# Altium schematic sheet FPGA_PSIO.SchDoc
size A3; SheetNumber: 3; SheetTotal: 5
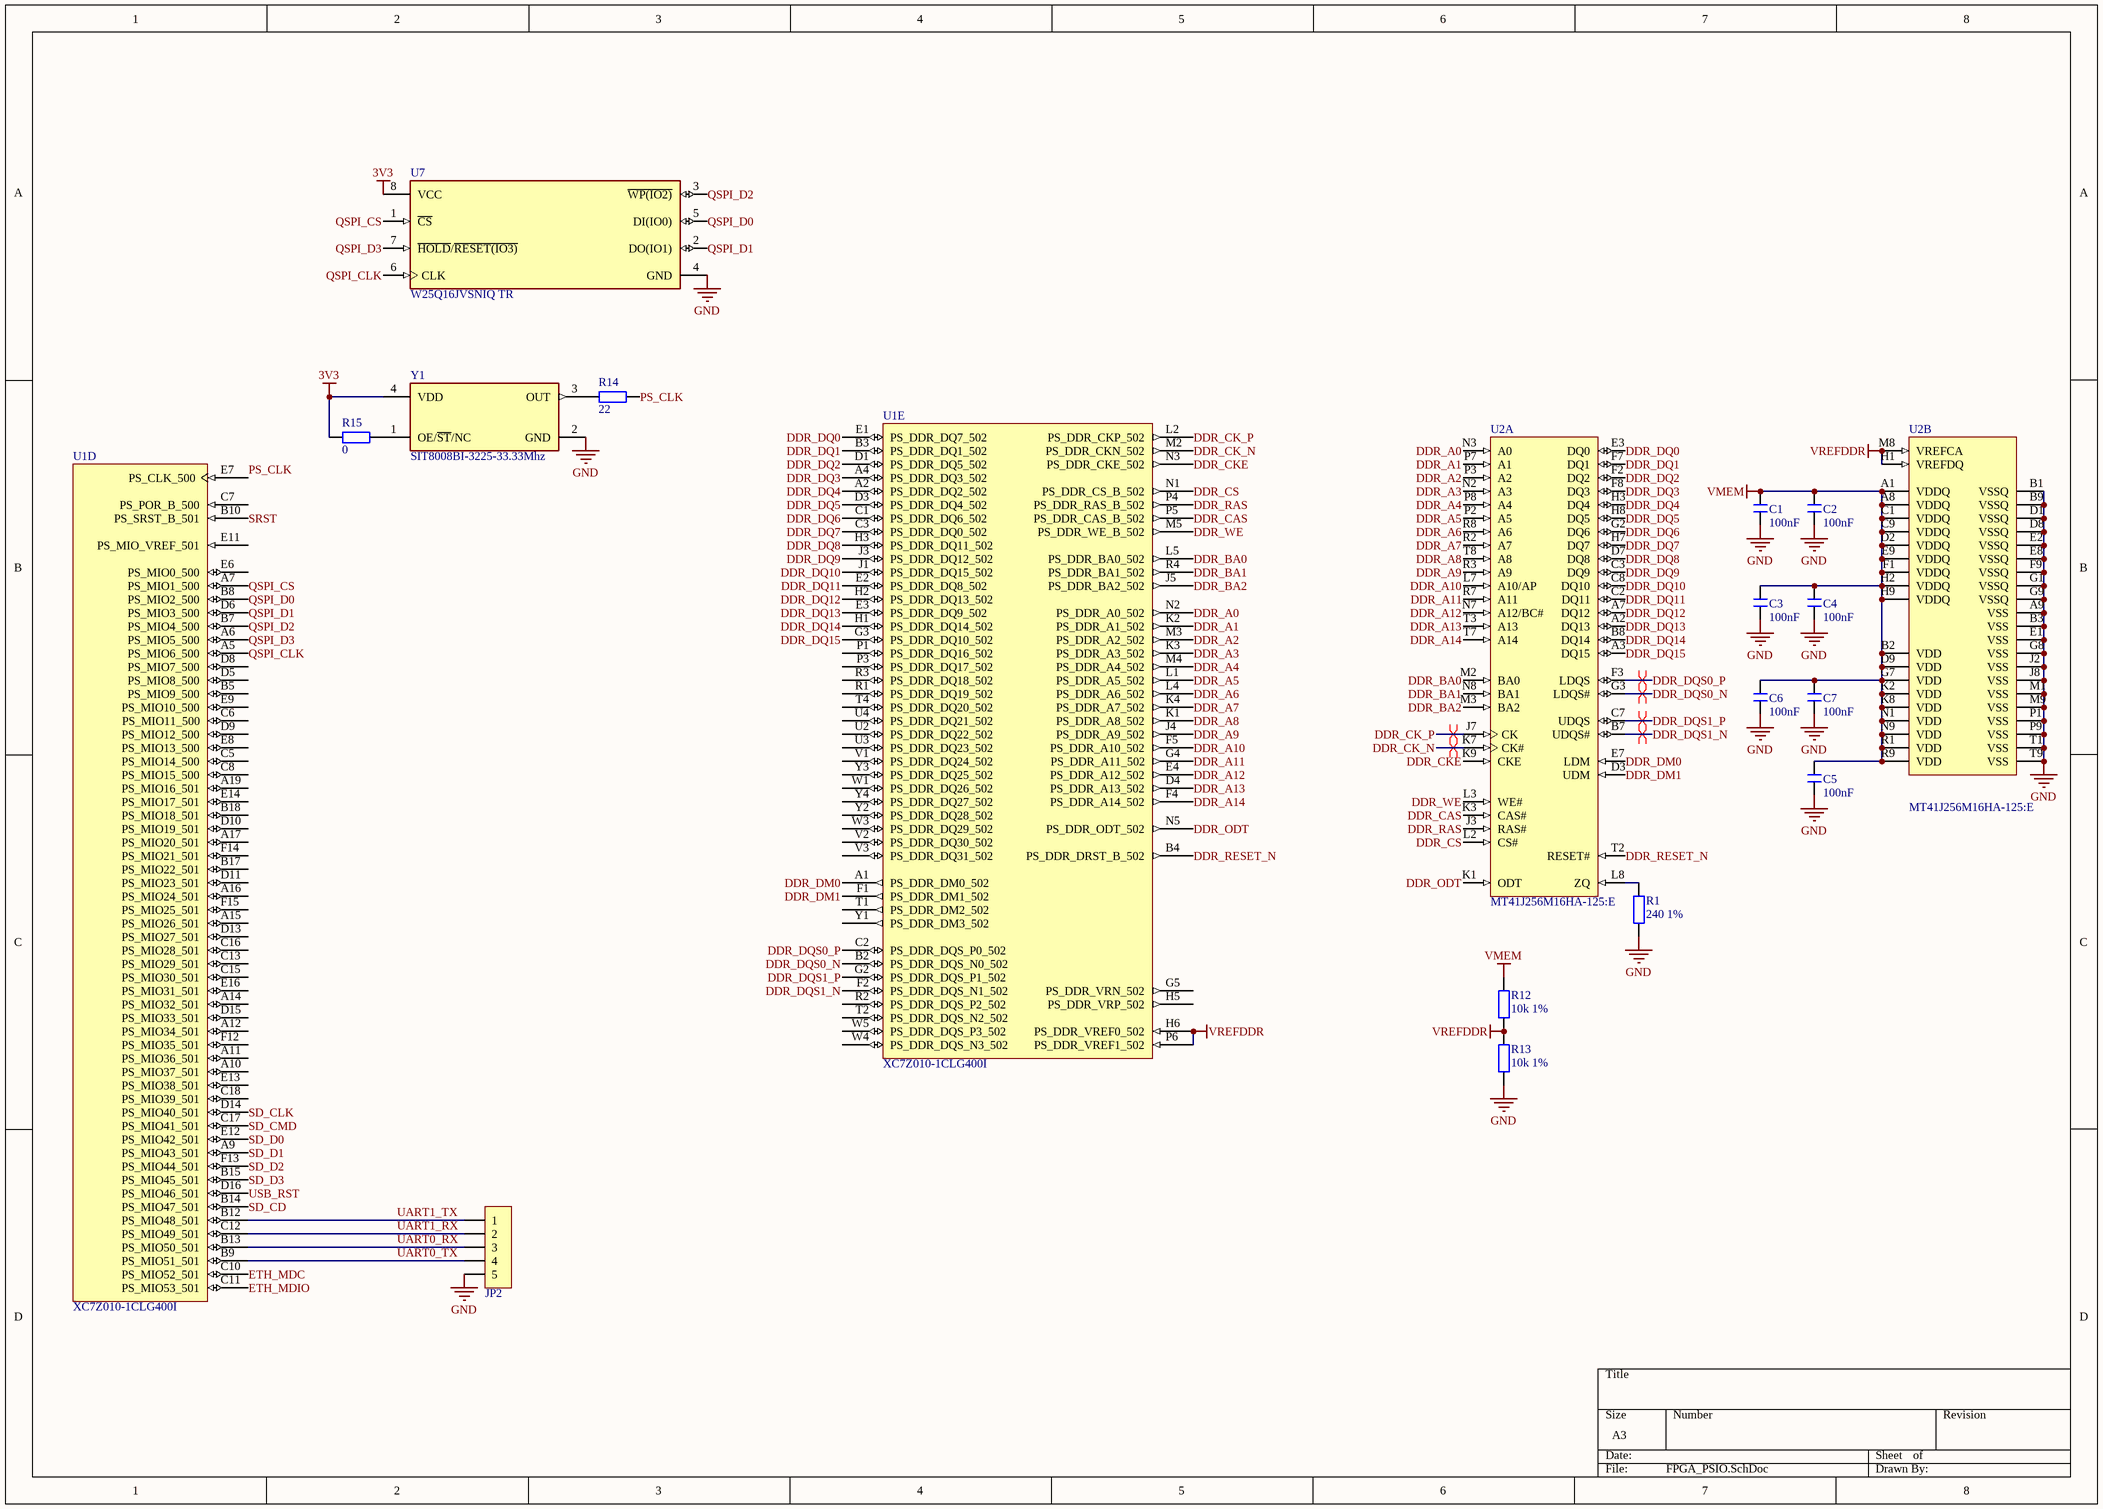
[diagram p0: FPGA_PSIO.SchDoc]

## Parts
C1  100nF  [C0402]
C2  100nF  [C0402]
C3  100nF  [C0402]
C4  100nF  [C0402]
C5  100nF  [C0402]
C6  100nF  [C0402]
C7  100nF  [C0402]
JP2  HDR-1X5  [HDR2.54-LI-5P]  (value not drawn)
R1  240 1%  [R0603]
R12  10k 1%  [R0402]
R13  10k 1%  [R0402]
R14  22  [R0402]
R15  0  [R0402]
U1  XC7Z010-1CLG400I  [CLG400]  (parts D,E of 9)
U2  MT41J256M16HA-125:E  [MICT-HA-96]  (parts A,B of 3)
U7  W25Q16JVSNIQ TR  [FP-SN-MFG]
Y1  SIT8008BI-3225-33.33Mhz  [FP-SiT8008-2-MFG]

## Nets
3V3: R15.1 U7.8(VCC) Y1.4(VDD)
GND: C1.2 C2.2 C3.2 C4.2 C5.2 C6.2 C7.2 JP2.5 R1.1 R13.1 U2.A9(VSS) U2.B1(VSSQ) U2.B3(VSS) U2.B9(VSSQ) U2.D1(VSSQ) U2.D8(VSSQ) U2.E1(VSS) U2.E2(VSSQ) U2.E8(VSSQ) U2.F9(VSSQ) U2.G1(VSSQ) U2.G8(VSS) U2.G9(VSSQ) U2.J2(VSS) U2.J8(VSS) U2.M1(VSS) U2.M9(VSS) U2.P1(VSS) U2.P9(VSS) U2.T1(VSS) U2.T9(VSS) U7.4(GND) Y1.2(GND)
VMEM: C1.1 C2.1 C3.1 C4.1 C5.1 C6.1 C7.1 R12.2 U2.A1(VDDQ) U2.A8(VDDQ) U2.B2(VDD) U2.C1(VDDQ) U2.C9(VDDQ) U2.D2(VDDQ) U2.D9(VDD) U2.E9(VDDQ) U2.F1(VDDQ) U2.G7(VDD) U2.H2(VDDQ) U2.H9(VDDQ) U2.K2(VDD) U2.K8(VDD) U2.N1(VDD) U2.N9(VDD) U2.R1(VDD) U2.R9(VDD)
VREFDDR: R12.1 R13.2 U1.H6(PS_DDR_VREF0_502) U1.P6(PS_DDR_VREF1_502) U2.H1(VREFDQ) U2.M8(VREFCA)
DDR_A0: U1.N2(PS_DDR_A0_502) U2.N3(A0)
DDR_A1: U1.K2(PS_DDR_A1_502) U2.P7(A1)
DDR_A2: U1.M3(PS_DDR_A2_502) U2.P3(A2)
DDR_A3: U1.K3(PS_DDR_A3_502) U2.N2(A3)
DDR_A4: U1.M4(PS_DDR_A4_502) U2.P8(A4)
DDR_A5: U1.L1(PS_DDR_A5_502) U2.P2(A5)
DDR_A6: U1.L4(PS_DDR_A6_502) U2.R8(A6)
DDR_A7: U1.K4(PS_DDR_A7_502) U2.R2(A7)
DDR_A8: U1.K1(PS_DDR_A8_502) U2.T8(A8)
DDR_A9: U1.J4(PS_DDR_A9_502) U2.R3(A9)
DDR_A10: U1.F5(PS_DDR_A10_502) U2.L7(A10/AP)
DDR_A11: U1.G4(PS_DDR_A11_502) U2.R7(A11)
DDR_A12: U1.E4(PS_DDR_A12_502) U2.N7(A12/BC#)
DDR_A13: U1.D4(PS_DDR_A13_502) U2.T3(A13)
DDR_A14: U1.F4(PS_DDR_A14_502) U2.T7(A14)
DDR_BA0: U1.L5(PS_DDR_BA0_502) U2.M2(BA0)
DDR_BA1: U1.R4(PS_DDR_BA1_502) U2.N8(BA1)
DDR_BA2: U1.J5(PS_DDR_BA2_502) U2.M3(BA2)
DDR_CAS: U1.P5(PS_DDR_CAS_B_502) U2.K3(CAS#)
DDR_CK_N: U1.M2(PS_DDR_CKN_502) U2.K7(CK#)
DDR_CK_P: U1.L2(PS_DDR_CKP_502) U2.J7(CK)
DDR_CKE: U1.N3(PS_DDR_CKE_502) U2.K9(CKE)
DDR_CS: U1.N1(PS_DDR_CS_B_502) U2.L2(CS#)
DDR_DM0: U1.A1(PS_DDR_DM0_502) U2.E7(LDM)
DDR_DM1: U1.F1(PS_DDR_DM1_502) U2.D3(UDM)
DDR_DQ0: U1.E1(PS_DDR_DQ7_502) U2.E3(DQ0)
DDR_DQ1: U1.B3(PS_DDR_DQ1_502) U2.F7(DQ1)
DDR_DQ2: U1.D1(PS_DDR_DQ5_502) U2.F2(DQ2)
DDR_DQ3: U1.A4(PS_DDR_DQ3_502) U2.F8(DQ3)
DDR_DQ4: U1.A2(PS_DDR_DQ2_502) U2.H3(DQ4)
DDR_DQ5: U1.D3(PS_DDR_DQ4_502) U2.H8(DQ5)
DDR_DQ6: U1.C1(PS_DDR_DQ6_502) U2.G2(DQ6)
DDR_DQ7: U1.C3(PS_DDR_DQ0_502) U2.H7(DQ7)
DDR_DQ8: U1.H3(PS_DDR_DQ11_502) U2.D7(DQ8)
DDR_DQ9: U1.J3(PS_DDR_DQ12_502) U2.C3(DQ9)
DDR_DQ10: U1.J1(PS_DDR_DQ15_502) U2.C8(DQ10)
DDR_DQ11: U1.E2(PS_DDR_DQ8_502) U2.C2(DQ11)
DDR_DQ12: U1.H2(PS_DDR_DQ13_502) U2.A7(DQ12)
DDR_DQ13: U1.E3(PS_DDR_DQ9_502) U2.A2(DQ13)
DDR_DQ14: U1.H1(PS_DDR_DQ14_502) U2.B8(DQ14)
DDR_DQ15: U1.G3(PS_DDR_DQ10_502) U2.A3(DQ15)
DDR_DQS0_N: U1.B2(PS_DDR_DQS_N0_502) U2.G3(LDQS#)
DDR_DQS0_P: U1.C2(PS_DDR_DQS_P0_502) U2.F3(LDQS)
DDR_DQS1_N: U1.F2(PS_DDR_DQS_N1_502) U2.B7(UDQS#)
DDR_DQS1_P: U1.G2(PS_DDR_DQS_P1_502) U2.C7(UDQS)
DDR_ODT: U1.N5(PS_DDR_ODT_502) U2.K1(ODT)
DDR_RAS: U1.P4(PS_DDR_RAS_B_502) U2.J3(RAS#)
DDR_RESET_N: U1.B4(PS_DDR_DRST_B_502) U2.T2(RESET#)
DDR_WE: U1.M5(PS_DDR_WE_B_502) U2.L3(WE#)
ETH_MDC: U1.C10(PS_MIO52_501)
ETH_MDIO: U1.C11(PS_MIO53_501)
PS_CLK: R14.1 U1.E7(PS_CLK_500)
QSPI_CLK: U1.A5(PS_MIO6_500) U7.6(CLK)
QSPI_CS: U1.A7(PS_MIO1_500) U7.1(~{CS})
QSPI_D0: U1.B8(PS_MIO2_500) U7.5(DI(IO0))
QSPI_D1: U1.D6(PS_MIO3_500) U7.2(DO(IO1))
QSPI_D2: U1.B7(PS_MIO4_500) U7.3(~{WP(IO2)})
QSPI_D3: U1.A6(PS_MIO5_500) U7.7(~{HOLD}/~{RESET(IO3)})
SD_CD: U1.B14(PS_MIO47_501)
SD_CLK: U1.D14(PS_MIO40_501)
SD_CMD: U1.C17(PS_MIO41_501)
SD_D0: U1.E12(PS_MIO42_501)
SD_D1: U1.A9(PS_MIO43_501)
SD_D2: U1.F13(PS_MIO44_501)
SD_D3: U1.B15(PS_MIO45_501)
SRST: U1.B10(PS_SRST_B_501)
UART0_RX: JP2.3 U1.B13(PS_MIO50_501)
UART0_TX: JP2.4 U1.B9(PS_MIO51_501)
UART1_RX: JP2.2 U1.C12(PS_MIO49_501)
UART1_TX: JP2.1 U1.B12(PS_MIO48_501)
USB_RST: U1.D16(PS_MIO46_501)
NetR1_2: R1.2 U2.L8(ZQ)
NetR14_2: R14.2 Y1.3(OUT)
NetR15_2: R15.2 Y1.1(OE/~{ST}/NC)

Not connected (* = marked no-connect by the designer): U1 A10(PS_MIO37_501) A11(PS_MIO36_501) A12(PS_MIO34_501) A14(PS_MIO32_501) A15(PS_MIO26_501) A16(PS_MIO24_501) A17(PS_MIO20_501) A19(PS_MIO16_501) B5(PS_MIO9_500) B17(PS_MIO22_501) B18(PS_MIO18_501) C5(PS_MIO14_500) C6(PS_MIO11_500) C7(PS_POR_B_500) C8(PS_MIO15_500) C13(PS_MIO29_501) C15(PS_MIO30_501) C16(PS_MIO28_501) C18(PS_MIO39_501) D5(PS_MIO8_500) D8(PS_MIO7_500) D9(PS_MIO12_500) D10(PS_MIO19_501) D11(PS_MIO23_501) D13(PS_MIO27_501) D15(PS_MIO33_501) E6(PS_MIO0_500) E8(PS_MIO13_500) E9(PS_MIO10_500) E11(PS_MIO_VREF_501) E13(PS_MIO38_501) E14(PS_MIO17_501) E16(PS_MIO31_501) F12(PS_MIO35_501) F14(PS_MIO21_501) F15(PS_MIO25_501) G5(PS_DDR_VRN_502) H5(PS_DDR_VRP_502) P1(PS_DDR_DQ16_502) P3(PS_DDR_DQ17_502) R1(PS_DDR_DQ19_502) R2(PS_DDR_DQS_P2_502) R3(PS_DDR_DQ18_502) T1(PS_DDR_DM2_502) T2(PS_DDR_DQS_N2_502) T4(PS_DDR_DQ20_502) U2(PS_DDR_DQ22_502) U3(PS_DDR_DQ23_502) U4(PS_DDR_DQ21_502) V1(PS_DDR_DQ24_502) V2(PS_DDR_DQ30_502) V3(PS_DDR_DQ31_502) W1(PS_DDR_DQ26_502) W3(PS_DDR_DQ29_502) W4(PS_DDR_DQS_N3_502) W5(PS_DDR_DQS_P3_502) Y1(PS_DDR_DM3_502) Y2(PS_DDR_DQ28_502) Y3(PS_DDR_DQ25_502) Y4(PS_DDR_DQ27_502)

## Layout directives
differential pair: DDR_CK_N, DDR_CK_P, DDR_DQS0_N, DDR_DQS0_P, DDR_DQS1_N, DDR_DQS1_P

## Library data of the parts
C1-C7 = C
JP2 = Header 5: 5P接插件; 版权归属: 源创客; BOM名称: 5P接插件; 学习资源: www.ooocke.com
R1 R12-R15 = R
U1 = CMP-0363-00008-3: 667 MHz Zynq™-7000 AP SoC, 130 PS I/O, 100 FPGA I/O, 400-Ball BGA, Speed Grade 1, Industrial Grade, Pb-Free; Speed Grade: -1; LUTs: 17600; Extensible Block RAM (# 36Kb Blocks): 240 KB (60); Flip Flops: 35200; PartNumber: XC7Z010-1CLG400I; Mounting Technology: Surface Mount; ComponentLink5URL: http://www.xilinx.com/support/documentation/user_guides/ug865-Zynq-7000-Pkg-Pinout.pdf; ComponentLink3URL: http://www.xilinx.com/support/documentation/data_sheets/ds187-XC7Z010-XC7Z020-Data-Sheet.pdf; PackageVersion: Rev 1.1, 09/2012; ComponentLink2Description: Package Specification; ComponentLink4Description: Package File; ComponentLink2URL: http://www.xilinx.com/support/documentation/user_guides/ug865-Zynq-7000-Pkg-Pinout.pdf; ComponentLink3Description: DC and AC Switching Characteristics; ComponentLink6Description: PCB and Layout Guide; ComponentLink4URL: http://www.xilinx.com/support/packagefiles/z7packages/xc7z010clg400pkg.txt; ComponentLink1URL: http://www.xilinx.com/support/documentation/data_sheets/ds190-Zynq-7000-Overview.pdf; Generic Part Number: XC7Z010; PackageReference: CLG400; ComponentLink1Description: Datasheet; RoHS: Pb-Free; ComponentLink6URL: http://www.xilinx.com/support/documentation/user_guides/ug483_7Series_PCB.pdf; DatasheetVersion: v1.2; PackageDescription: Wire-Bond Chip-Scale BGA, Body 17 x 17 mm, 0.8 mm Pitch; ComponentLink5Description: Packaging and Pinout; Code_JEDEC: MO-275-MMAA-1
U2 = CMP-2000-04968-1: 4 Gb DDR3-1600 SDRAM, 256 Mb x 16, 1.25 ns, 1.5 V, 0 to 95 degC, 96-Ball FBGA, Pb-Free; Manufacturer: Micron; Operating Supply Voltage: 1.5V; Address Bus Width: 18Bit; Density: 4Gb; Data Bus Width: 16Bit; Maximum Clock Rate: 1600MHz; Rad Hard: No; Package: 96FBGA; Operating Temperature: 0to95degC; Package Description: 96-Ball Fine-Pitch Ball Grid Array, Body 14 x 9 mm, Pitch 0.8 mm; Package Reference: HA-96; Manufacturer URL: https://www.micron.com/; Datasheet URL: http://passthrough.fw-notify.net/download/888500/http://download.siliconexpert.com/pdfs/2013/4/14/9/8/34/442/mic_/manual/234gb_ddr3_sdram.pdf; Datasheet Version: Rev. M, 04/2013; Number of Bits per Word: 16Bit; Type: DDR3SDRAM
U7 = CMP-78876-000009-1: IC FLASH 16MBIT SPI/QUAD 8SOIC; Memory Size: 16Mb; Frequency: 133MHz; Memory Type: Non-Volatile; Case/Package: SOIC; Series: SpiFlash®; Max Operating Temperature: 85°C; Packaging: Tape and Reel; Min Operating Temperature: -40°C; Mount: Surface Mount
Y1 = CMP-25159-264104-1: Oscillator MEMS 1MHz to 110MHz ±20ppm (Stability) LVCMOS 2.5V/2.8V/3V/3.3V Medical 4-Pin QFN SMD T/R